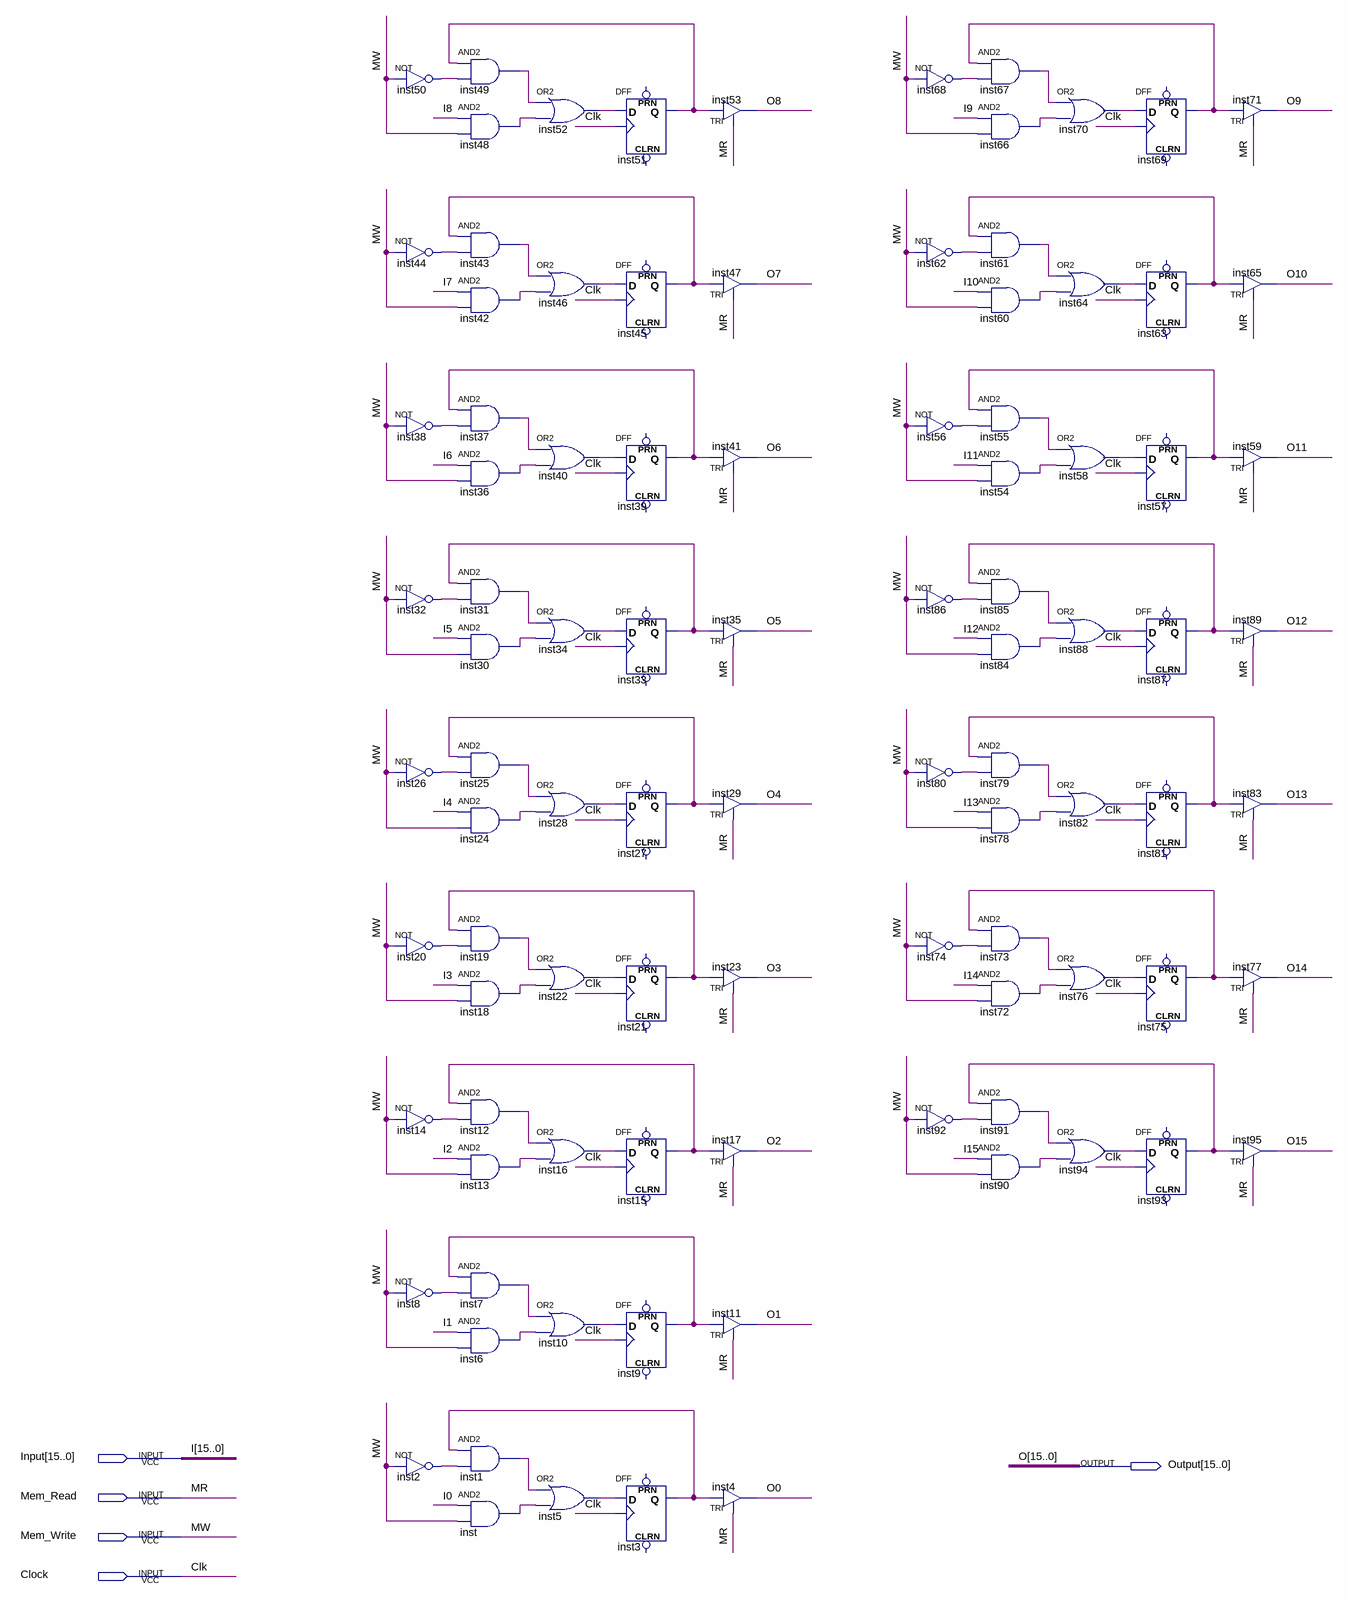
[diagram p0: schematic sheet]
// Quartus schematic memorycell.bdf as structural Verilog: 96 symbols, 5 pins
module memorycell (
  input  [15:0] Input,
  input  Mem_Read,
  input  Mem_Write,
  input  Clock,
  output [15:0] Output
);

  wire inst1_out, inst2_out, inst3_q, inst5_out, inst6_out, inst7_out, inst8_out, inst9_q, inst10_out,
       inst12_out, inst13_out, inst14_out, inst15_q, inst16_out, inst18_out, inst19_out, inst20_out,
       inst21_q, inst22_out, inst24_out, inst25_out, inst26_out, inst27_q, inst28_out, inst30_out,
       inst31_out, inst32_out, inst33_q, inst34_out, inst36_out, inst37_out, inst38_out, inst39_q,
       inst40_out, inst42_out, inst43_out, inst44_out, inst45_q, inst46_out, inst48_out, inst49_out,
       inst50_out, inst51_q, inst52_out, inst54_out, inst55_out, inst56_out, inst57_q, inst58_out,
       inst60_out, inst61_out, inst62_out, inst63_q, inst64_out, inst66_out, inst67_out, inst68_out,
       inst69_q, inst70_out, inst72_out, inst73_out, inst74_out, inst75_q, inst76_out, inst78_out,
       inst79_out, inst80_out, inst81_q, inst82_out, inst84_out, inst85_out, inst86_out, inst87_q,
       inst88_out, inst90_out, inst91_out, inst92_out, inst93_q, inst94_out, inst_out;

  not inst50 (inst50_out, Mem_Write);
  not inst44 (inst44_out, Mem_Write);
  not inst38 (inst38_out, Mem_Write);
  not inst32 (inst32_out, Mem_Write);
  not inst26 (inst26_out, Mem_Write);
  not inst20 (inst20_out, Mem_Write);
  not inst14 (inst14_out, Mem_Write);
  not inst8 (inst8_out, Mem_Write);
  not inst2 (inst2_out, Mem_Write);
  and inst49 (inst49_out, inst51_q, inst50_out);
  and inst48 (inst48_out, Input[8], Mem_Write);
  and inst43 (inst43_out, inst45_q, inst44_out);
  and inst42 (inst42_out, Input[7], Mem_Write);
  and inst37 (inst37_out, inst39_q, inst38_out);
  and inst36 (inst36_out, Input[6], Mem_Write);
  and inst31 (inst31_out, inst33_q, inst32_out);
  and inst30 (inst30_out, Input[5], Mem_Write);
  and inst25 (inst25_out, inst27_q, inst26_out);
  and inst24 (inst24_out, Input[4], Mem_Write);
  and inst19 (inst19_out, inst21_q, inst20_out);
  and inst18 (inst18_out, Input[3], Mem_Write);
  and inst12 (inst12_out, inst15_q, inst14_out);
  and inst13 (inst13_out, Input[2], Mem_Write);
  and inst7 (inst7_out, inst9_q, inst8_out);
  and inst6 (inst6_out, Input[1], Mem_Write);
  and inst1 (inst1_out, inst3_q, inst2_out);
  and inst (inst_out, Input[0], Mem_Write);
  or inst52 (inst52_out, inst49_out, inst48_out);
  or inst46 (inst46_out, inst43_out, inst42_out);
  or inst40 (inst40_out, inst37_out, inst36_out);
  or inst34 (inst34_out, inst31_out, inst30_out);
  or inst28 (inst28_out, inst25_out, inst24_out);
  or inst22 (inst22_out, inst19_out, inst18_out);
  or inst16 (inst16_out, inst12_out, inst13_out);
  or inst10 (inst10_out, inst7_out, inst6_out);
  or inst5 (inst5_out, inst1_out, inst_out);
  DFF inst51 (.CLK(Clock), .D(inst52_out), .Q(inst51_q));  // open: CLRN, PRN
  DFF inst45 (.CLK(Clock), .D(inst46_out), .Q(inst45_q));  // open: CLRN, PRN
  DFF inst39 (.CLK(Clock), .D(inst40_out), .Q(inst39_q));  // open: CLRN, PRN
  DFF inst33 (.CLK(Clock), .D(inst34_out), .Q(inst33_q));  // open: CLRN, PRN
  DFF inst27 (.CLK(Clock), .D(inst28_out), .Q(inst27_q));  // open: CLRN, PRN
  DFF inst21 (.CLK(Clock), .D(inst22_out), .Q(inst21_q));  // open: CLRN, PRN
  DFF inst15 (.CLK(Clock), .D(inst16_out), .Q(inst15_q));  // open: CLRN, PRN
  DFF inst9 (.CLK(Clock), .D(inst10_out), .Q(inst9_q));  // open: CLRN, PRN
  DFF inst3 (.CLK(Clock), .D(inst5_out), .Q(inst3_q));  // open: CLRN, PRN
  TRI inst53 (.IN(inst51_q), .OE(Mem_Read), .OUT(Output[8]));
  TRI inst47 (.IN(inst45_q), .OE(Mem_Read), .OUT(Output[7]));
  TRI inst41 (.IN(inst39_q), .OE(Mem_Read), .OUT(Output[6]));
  TRI inst35 (.IN(inst33_q), .OE(Mem_Read), .OUT(Output[5]));
  TRI inst29 (.IN(inst27_q), .OE(Mem_Read), .OUT(Output[4]));
  TRI inst23 (.IN(inst21_q), .OE(Mem_Read), .OUT(Output[3]));
  TRI inst17 (.IN(inst15_q), .OE(Mem_Read), .OUT(Output[2]));
  TRI inst11 (.IN(inst9_q), .OE(Mem_Read), .OUT(Output[1]));
  TRI inst4 (.IN(inst3_q), .OE(Mem_Read), .OUT(Output[0]));
  not inst68 (inst68_out, Mem_Write);
  not inst62 (inst62_out, Mem_Write);
  not inst56 (inst56_out, Mem_Write);
  not inst86 (inst86_out, Mem_Write);
  not inst80 (inst80_out, Mem_Write);
  not inst74 (inst74_out, Mem_Write);
  not inst92 (inst92_out, Mem_Write);
  and inst67 (inst67_out, inst69_q, inst68_out);
  and inst66 (inst66_out, Input[9], Mem_Write);
  and inst61 (inst61_out, inst63_q, inst62_out);
  and inst60 (inst60_out, Input[10], Mem_Write);
  and inst55 (inst55_out, inst57_q, inst56_out);
  and inst54 (inst54_out, Input[11], Mem_Write);
  and inst85 (inst85_out, inst87_q, inst86_out);
  and inst84 (inst84_out, Input[12], Mem_Write);
  and inst79 (inst79_out, inst81_q, inst80_out);
  and inst78 (inst78_out, Input[13], Mem_Write);
  and inst73 (inst73_out, inst75_q, inst74_out);
  and inst72 (inst72_out, Input[14], Mem_Write);
  and inst91 (inst91_out, inst93_q, inst92_out);
  and inst90 (inst90_out, Input[15], Mem_Write);
  or inst70 (inst70_out, inst67_out, inst66_out);
  or inst64 (inst64_out, inst61_out, inst60_out);
  or inst58 (inst58_out, inst55_out, inst54_out);
  or inst88 (inst88_out, inst85_out, inst84_out);
  or inst82 (inst82_out, inst79_out, inst78_out);
  or inst76 (inst76_out, inst73_out, inst72_out);
  or inst94 (inst94_out, inst91_out, inst90_out);
  DFF inst69 (.CLK(Clock), .D(inst70_out), .Q(inst69_q));  // open: CLRN, PRN
  DFF inst63 (.CLK(Clock), .D(inst64_out), .Q(inst63_q));  // open: CLRN, PRN
  DFF inst57 (.CLK(Clock), .D(inst58_out), .Q(inst57_q));  // open: CLRN, PRN
  DFF inst87 (.CLK(Clock), .D(inst88_out), .Q(inst87_q));  // open: CLRN, PRN
  DFF inst81 (.CLK(Clock), .D(inst82_out), .Q(inst81_q));  // open: CLRN, PRN
  DFF inst75 (.CLK(Clock), .D(inst76_out), .Q(inst75_q));  // open: CLRN, PRN
  DFF inst93 (.CLK(Clock), .D(inst94_out), .Q(inst93_q));  // open: CLRN, PRN
  TRI inst71 (.IN(inst69_q), .OE(Mem_Read), .OUT(Output[9]));
  TRI inst65 (.IN(inst63_q), .OE(Mem_Read), .OUT(Output[10]));
  TRI inst59 (.IN(inst57_q), .OE(Mem_Read), .OUT(Output[11]));
  TRI inst89 (.IN(inst87_q), .OE(Mem_Read), .OUT(Output[12]));
  TRI inst83 (.IN(inst81_q), .OE(Mem_Read), .OUT(Output[13]));
  TRI inst77 (.IN(inst75_q), .OE(Mem_Read), .OUT(Output[14]));
  TRI inst95 (.IN(inst93_q), .OE(Mem_Read), .OUT(Output[15]));

  // Other names for the same wires on the sheet: Clk = Clock; I[15:0] = Input; I0 = Input[0]; I1 = Input[1];
  //   I2 = Input[2]; I3 = Input[3]; I4 = Input[4]; I5 = Input[5]; I6 = Input[6]; I7 = Input[7]; I8 = Input[8];
  //   I9 = Input[9]; I10 = Input[10]; I11 = Input[11]; I12 = Input[12]; I13 = Input[13]; I14 = Input[14];
  //   I15 = Input[15]; MR = Mem_Read; MW = Mem_Write; O[15:0] = Output; O0 = Output[0]; O1 = Output[1];
  //   O2 = Output[2]; O3 = Output[3]; O4 = Output[4]; O5 = Output[5]; O6 = Output[6]; O7 = Output[7]; O8 = Output[8];
  //   O9 = Output[9]; O10 = Output[10]; O11 = Output[11]; O12 = Output[12]; O13 = Output[13]; O14 = Output[14];
  //   O15 = Output[15]
endmodule
